# EAGLE schematic TCS3200_board (EAGLE 9.1.2)
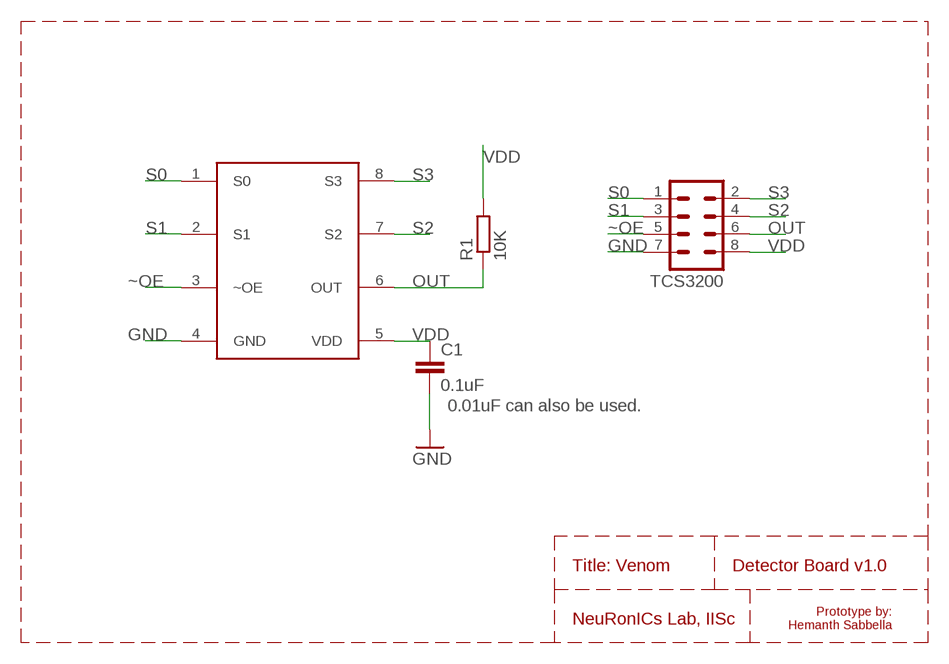
[diagram p0: schematic, sheet 1]

## Parts
C1  0.1uF  C-EUC0805  [C0805]
R1  10K  R-EU_R0805  [R0805]
TCS3200  MA04-2  [MA04-2]
U$1  TCS3200  [TCS3200]

## Nets
GND: C1.2 TCS3200.7 U$1.4(GND)
OUT: R1.1 TCS3200.6 U$1.6(OUT)
S0: TCS3200.1 U$1.1(S0)
S1: TCS3200.3 U$1.2(S1)
S2: TCS3200.4 U$1.7(S2)
S3: TCS3200.2 U$1.8(S3)
VDD: C1.1 R1.2 TCS3200.8 U$1.5(VDD)
~OE: TCS3200.5 U$1.3(~OE)

## Notes on the sheet
- 0.01uF can also be used.
- Title: Venom | Detector Board v1.0
- Prototype by:
  Hemanth Sabbella
- NeuRonICs Lab, IISc

## Library data of the parts
C1 = rcl:C-EU: CAPACITOR, European symbol; SPICEPREFIX: C
R1 = rcl:R-EU_: RESISTOR, European symbol; SPICEPREFIX: R
TCS3200 = con-lstb:MA04-2: PIN HEADER; OC_FARNELL: unknown; OC_NEWARK: unknown
U$1 = TCS3200:TCS3200: TCS3200 is a color sensor with array of photodiodes from 470nm to 700nm range